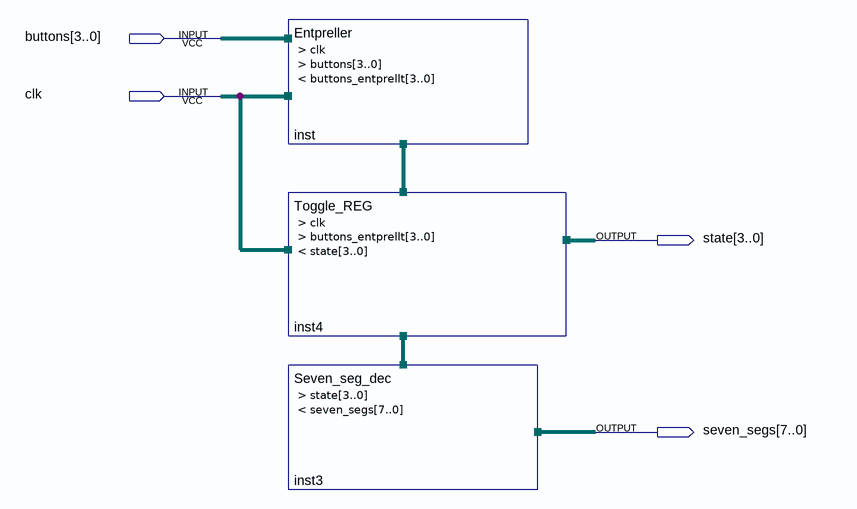
[diagram p0: schematic sheet]
// Quartus schematic LAB_7_Seg_final.bdf as structural Verilog: 3 symbols, 4 pins
module LAB_7_Seg_final (
  input  [3:0] buttons,
  input  clk,
  output [3:0] state,
  output [7:0] seven_segs
);

  wire [3:0] buttons_entprellt;

  Entpreller inst (.clk(clk), .buttons(buttons), .buttons_entprellt(buttons_entprellt));
  Toggle_REG inst4 (.clk(clk), .buttons_entprellt(buttons_entprellt), .state(state));
  Seven_seg_dec inst3 (.state(state), .seven_segs(seven_segs));
endmodule
